# EAGLE design Jig-Lower-Layer (EAGLE 7.7.0)
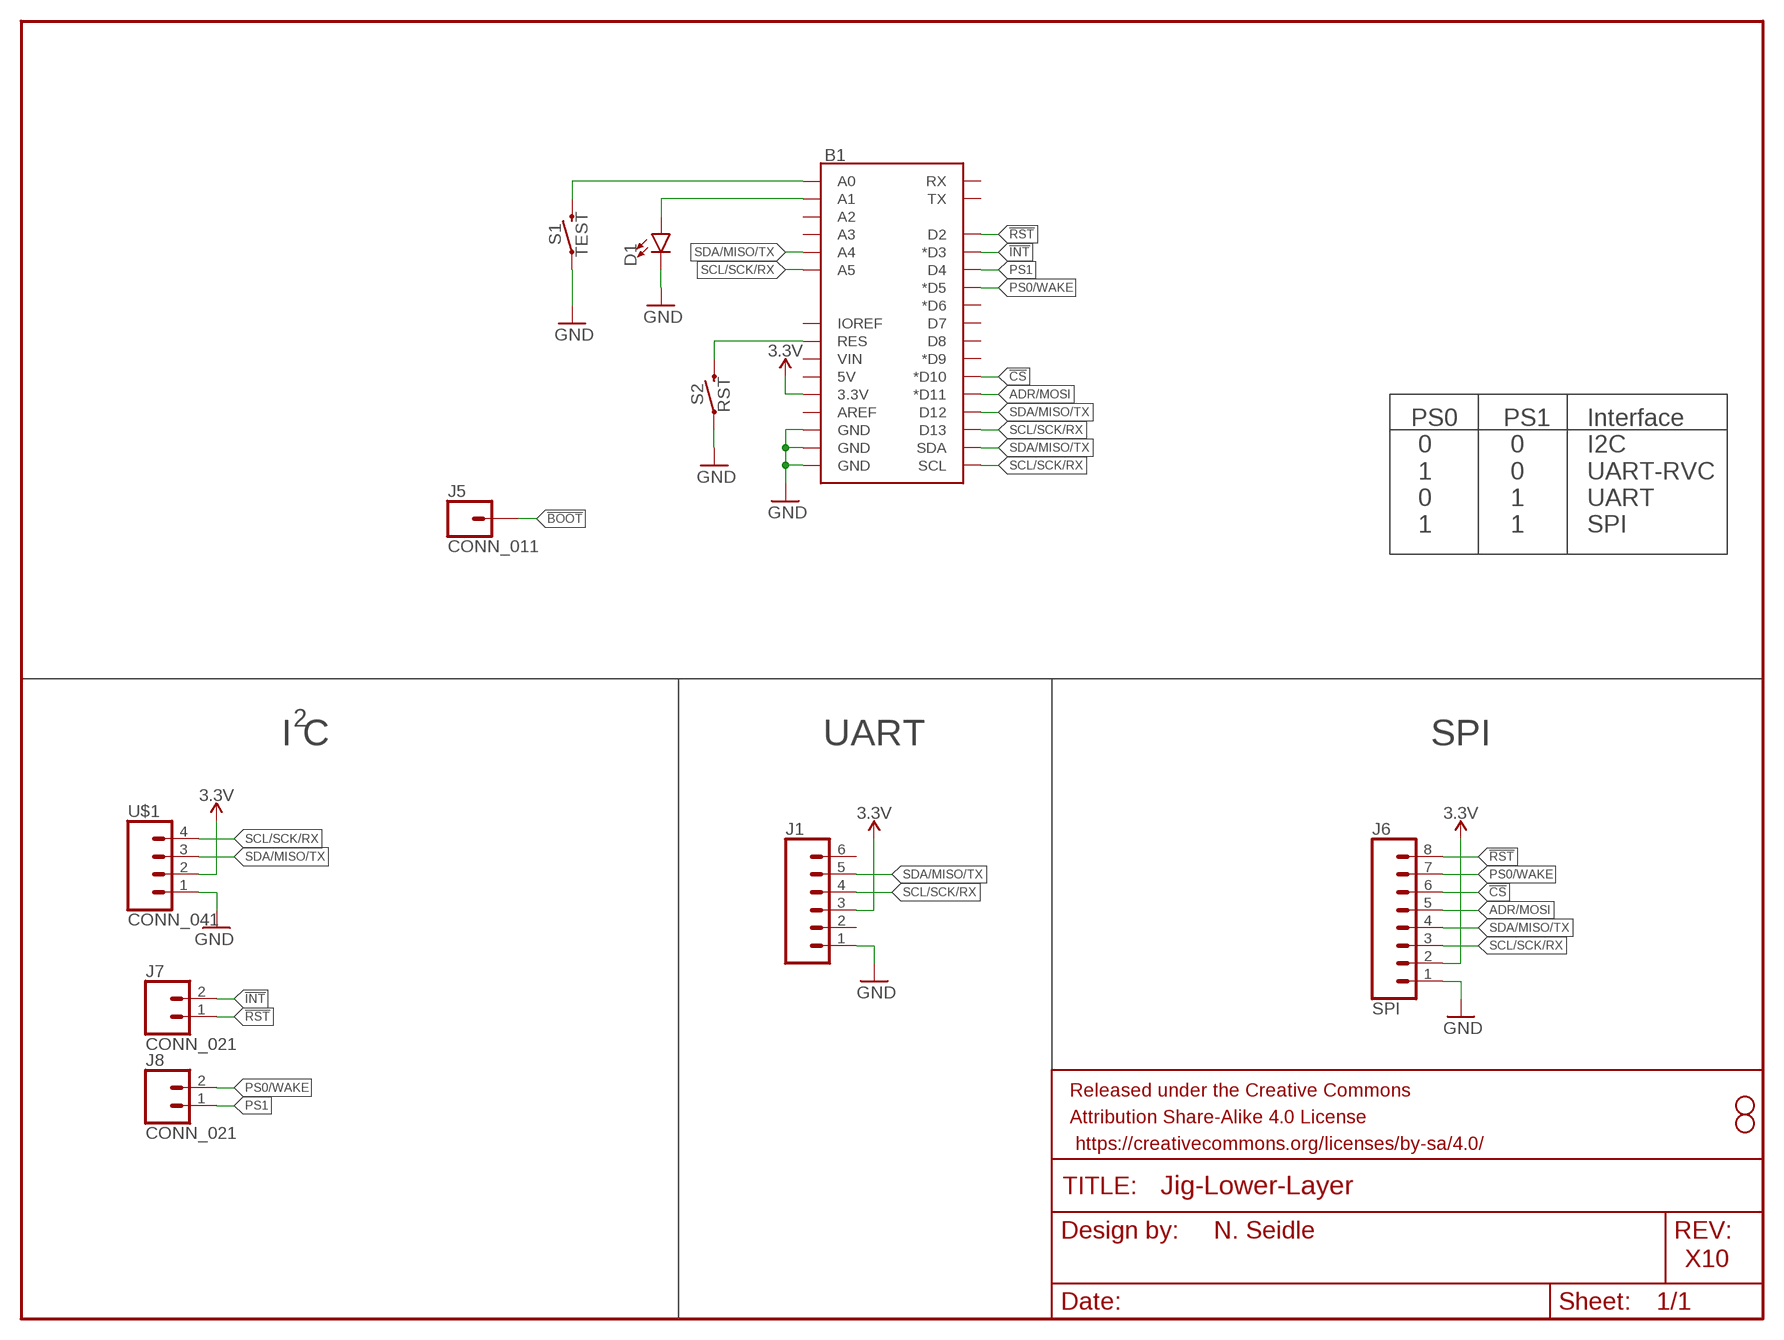
[diagram p0: schematic, sheet 1]

## Parts
B1  ARDUINO_UNO_R3_SHIELDBASIC  [UNO_R3_SHIELD]
D1  LED5MM  [LED_5MM]
FRAME1  FRAME-LETTER  [CREATIVE_COMMONS]
J1  CONN_061  [1X06]
J5  CONN_011  [1X01]
J6  SPI  CONN_081  [1X08]
J7  CONN_021  [1X02]
J8  CONN_021  [1X02]
JP3  STAND-OFF  [STAND-OFF]
JP4  STAND-OFF  [STAND-OFF]
S1  TEST  MOMENTARY-SWITCH-SPST-PTH-12MM  [TACTILE_SWITCH_PTH_12MM]
S2  RST  MOMENTARY-SWITCH-SPST-PTH-12MM  [TACTILE_SWITCH_PTH_12MM]
U$1  CONN_041  [1X04]

## Nets
3.3V: B1.3.3V J1.3 J6.2 U$1.2
!BOOT: J5.1
!CS: B1.D10(*D10) J6.6
!INT: B1.D3(*D3) J7.2
!RST: B1.D2 J6.8 J7.1
ADR/MOSI: B1.D11(*D11) J6.5
GND: B1.GND@0(GND) B1.GND@1(GND) B1.GND@2(GND) D1.K(C) J1.1 J6.1 S1.1 S2.1 U$1.1
N$1: B1.A0 S1.3
N$2: B1.A1 D1.A
N$3: B1.RES S2.3
PS0/WAKE: B1.D5(*D5) J6.7 J8.2
PS1: B1.D4 J8.1
SCL/SCK/RX: B1.A5 B1.D13 B1.SCL J1.4 J6.3 U$1.4
SDA/MISO/TX: B1.A4 B1.D12 B1.SDA J1.5 J6.4 U$1.3
Unconnected: B1.5V B1.A2 B1.A3 B1.AREF B1.D6(*D6) B1.D7 B1.D8 B1.D9(*D9) B1.IOREF B1.RX B1.TX B1.VIN J1.2 J1.6

## Notes on the sheet
- PS0
   0
   1
   0
   1
- PS1
   0
   0
   1
   1
- Interface
  I2C
  UART-RVC
  UART
  SPI
- 2
- I C | UART | SPI
- N. Seidle
- X10

## Library data of the parts
B1 = SparkFun-Boards:ARDUINO_UNO_R3_SHIELD: Arduino R3 Shield Footprint Shield form compatible with the Arduino Uno R3. SparkFun Products: MG2639 Cellular Shield <https://www.sparkfun.com/products/13120> MIDI Shield <https://www.sparkfun.com/products/12898> R3 Stackable Headers Kit <https://www.sparkfun.com/products/11417>
D1 = SparkFun-LED:LED: LED (Generic) Standard schematic elements and footprints for 5mm, 3mm, 1206, and 0603 sized LEDs. Generic LEDs with no color specified.
FRAME1 = SparkFun-Aesthetics:FRAME-LETTER: Schematic Frame - Letter Standard 8.5x11 US Letter frame
J1 = Pogo-Footprints:CONN_06: Multi connection point. Often used as Generic Header-pin footprint for 0.1 inch spaced/style header connections On any of the 0.1 inch spaced packages, you can populate with these: Break Away Headers - Straight <https://www.sparkfun.com/products/116> (PRT-00116) Break Away Male Headers - Right Angle <https://www.sparkfun.com/products/553> (PRT-00553) Female Headers <https://www.sparkfun.com/products/115> (PRT-00115) Break Away Headers - Machine Pin <https://www.sparkfun.com/products/117> (PRT-00117) Break Away Female Headers - Swiss Machine Pin <https://www.sparkfun.com/products/743> (PRT-00743) Arduino Stackable Header - 6 Pin <https://www.sparkfun.com/products/9280> (PRT-09280) For SCREWTERMINALS and SPRING TERMINALS visit here: Screw Terimnals on SparkFun.com <https://www.sparkfun.com/search/results?term=Screw+Terminals> (5mm/3.5mm/2.54mm spacing) This device is also useful as a general connection point to wire up your design to another part of your project. Our various solder wires solder well into these plated through hole pads. Hook-Up Wire - Assortment (Stranded, 22 AWG) <https://www.sparkfun.com/products/11375> (PRT-11375) Hook-Up Wire - Assortment (Solid Core, 22 AWG) <https://www.sparkfun.com/products/11367> (PRT-11367) View the entire wire category on our website here <https://www.sparkfun.com/categories/141>; PROD_ID: CONN-08437
J5 = Pogo-Footprints:CONN_01
J6 = Pogo-Footprints:CONN_08
J7 J8 = Pogo-Footprints:CONN_02
JP3 JP4 = SparkFun:STAND-OFF: Stand Off This is the mechanical footprint for a #4 phillips button head screw. Use the keepout ring to avoid running the screw head into surrounding components. SKU : PRT-00447
S1 S2 = SparkFun-Switches:MOMENTARY-SWITCH-SPST: Momentary Switch (Pushbutton) - SPST Normally-open (NO) SPST momentary switches (buttons, pushbuttons). Variants PTH-12MM - 12mm square, through-hole Momentary Pushbutton Switch - 12mm Square <https://www.sparkfun.com/products/9190> (COM-09190) PTH-6.0MM, PTH-6.0MM-KIT - 6.0mm square, through-hole Mini Pushbutton Switch <https://www.sparkfun.com/products/97> (COM-00097) KIT package intended for soldering kit's - only one side of pads' copper is exposed. PTH-RIGHT-ANGLE-KIT - Right-angle, through-hole Right Angle Tactile Button <https://www.sparkfun.com/products/10791> - Used on SparkFun BigTime Watch Kit <https://www.sparkfun.com/products/11734> SMD-12MM - 12mm square, surface-mount Tactile Button - SMD (12mm) <https://www.sparkfun.com/products/12993> (COM-12993) Used on SparkFun PicoBoard <https://www.sparkfun.com/products/11888> SMD-4.5MM - 4.5mm Square Trackball Switch Used on SparkFun Blackberry Trackballer Breakout <https://www.sparkfun.com/products/13169> SMD-4.6MMX2.8MM - 4.60mm x 2.80mm, surface mount Used on SparkFun SAMD21 Mini Breakout <https://www.sparkfun.com/products/13664> SMD-5.2MM, SMD-5.2-REDUNDANT - 5.2mm square, surface-mount Mini Pushbutton Switch - SMD <https://www.sparkfun.com/products/8720> (COM-08720) Used on Arduino Pro Mini <https://www.sparkfun.com/products/11114> REDUNDANT package connects both switch circuits together SMD-6.0X3.5MM - 6.0 x 3.5mm, surface mount Momentary Reset Switch SMD <https://www.sparkfun.com/products/8229> (COM-08229) SMD-6.2MM-TALL - 6.2mm square, surface mount Tactile Button - SMD (6mm) <https://www.sparkfun.com/products/12992> Used on SparkFun Digital Sandbox <https://www.sparkfun.com/products/12651> SMD-RIGHT-ANGLE - Right-angle, surface mount Used on SparkFun Block for Intel® Edison - Arduino <https://www.sparkfun.com/products/13036>; PROD_ID: SWCH-09185; SF_SKU: COM-09190
U$1 = Pogo-Footprints:CONN_04

## Board
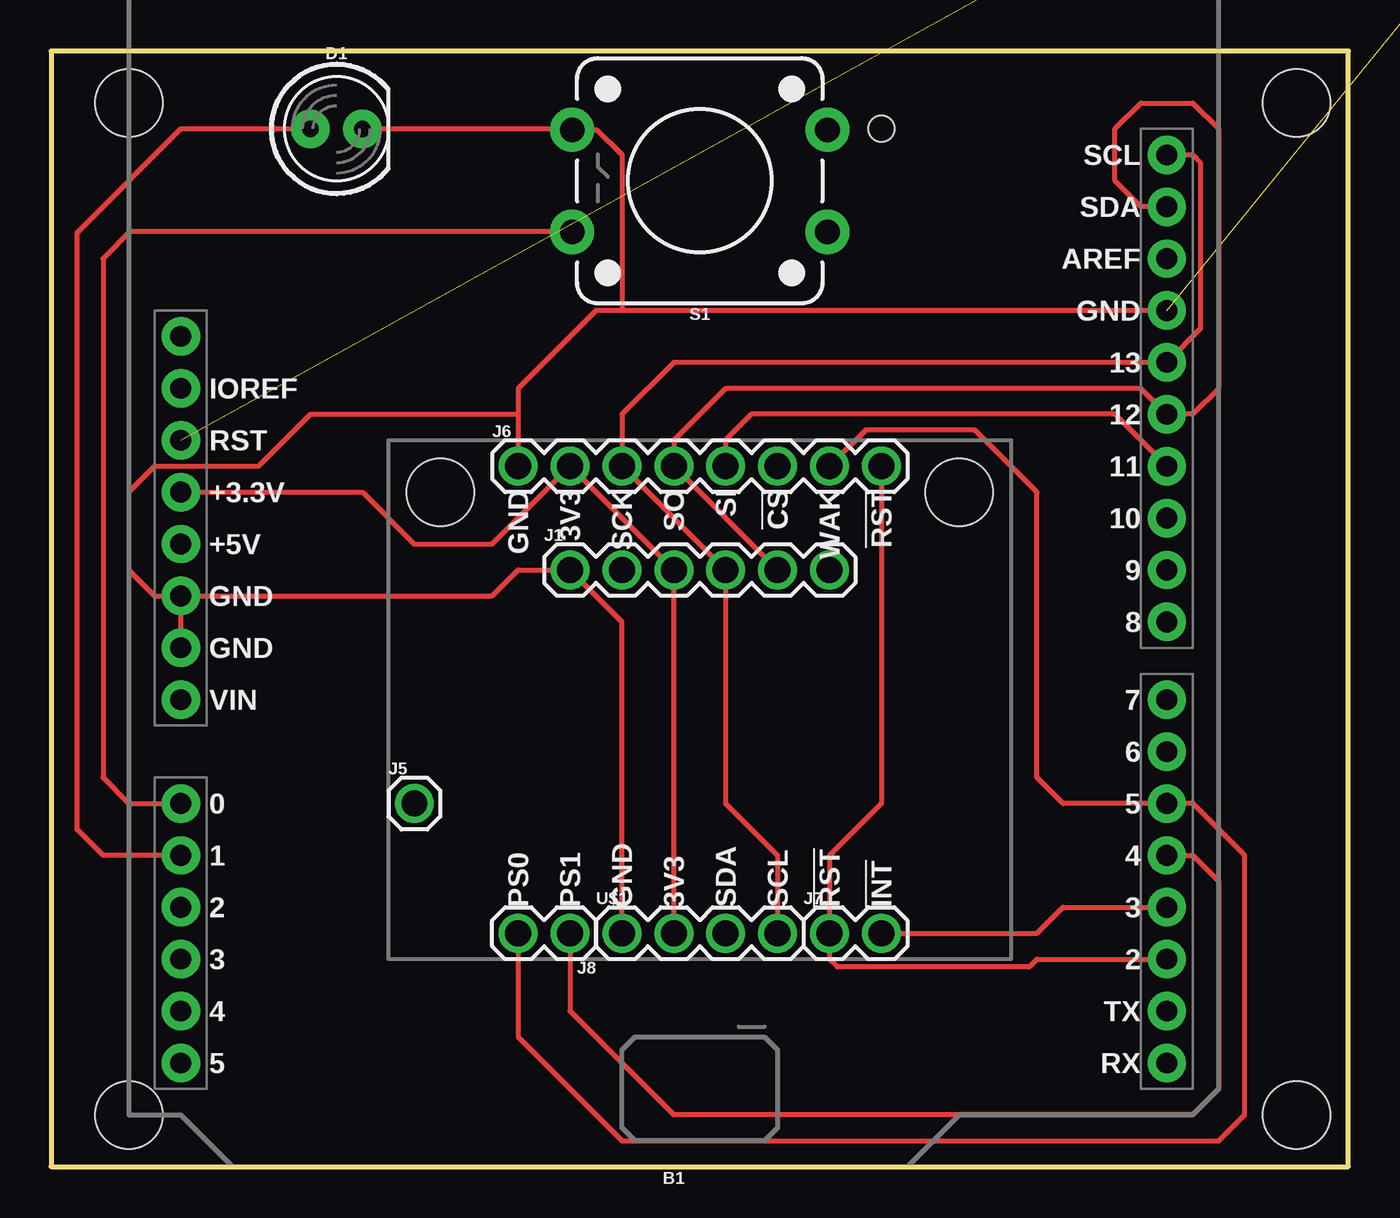
[diagram p1: board, top side]
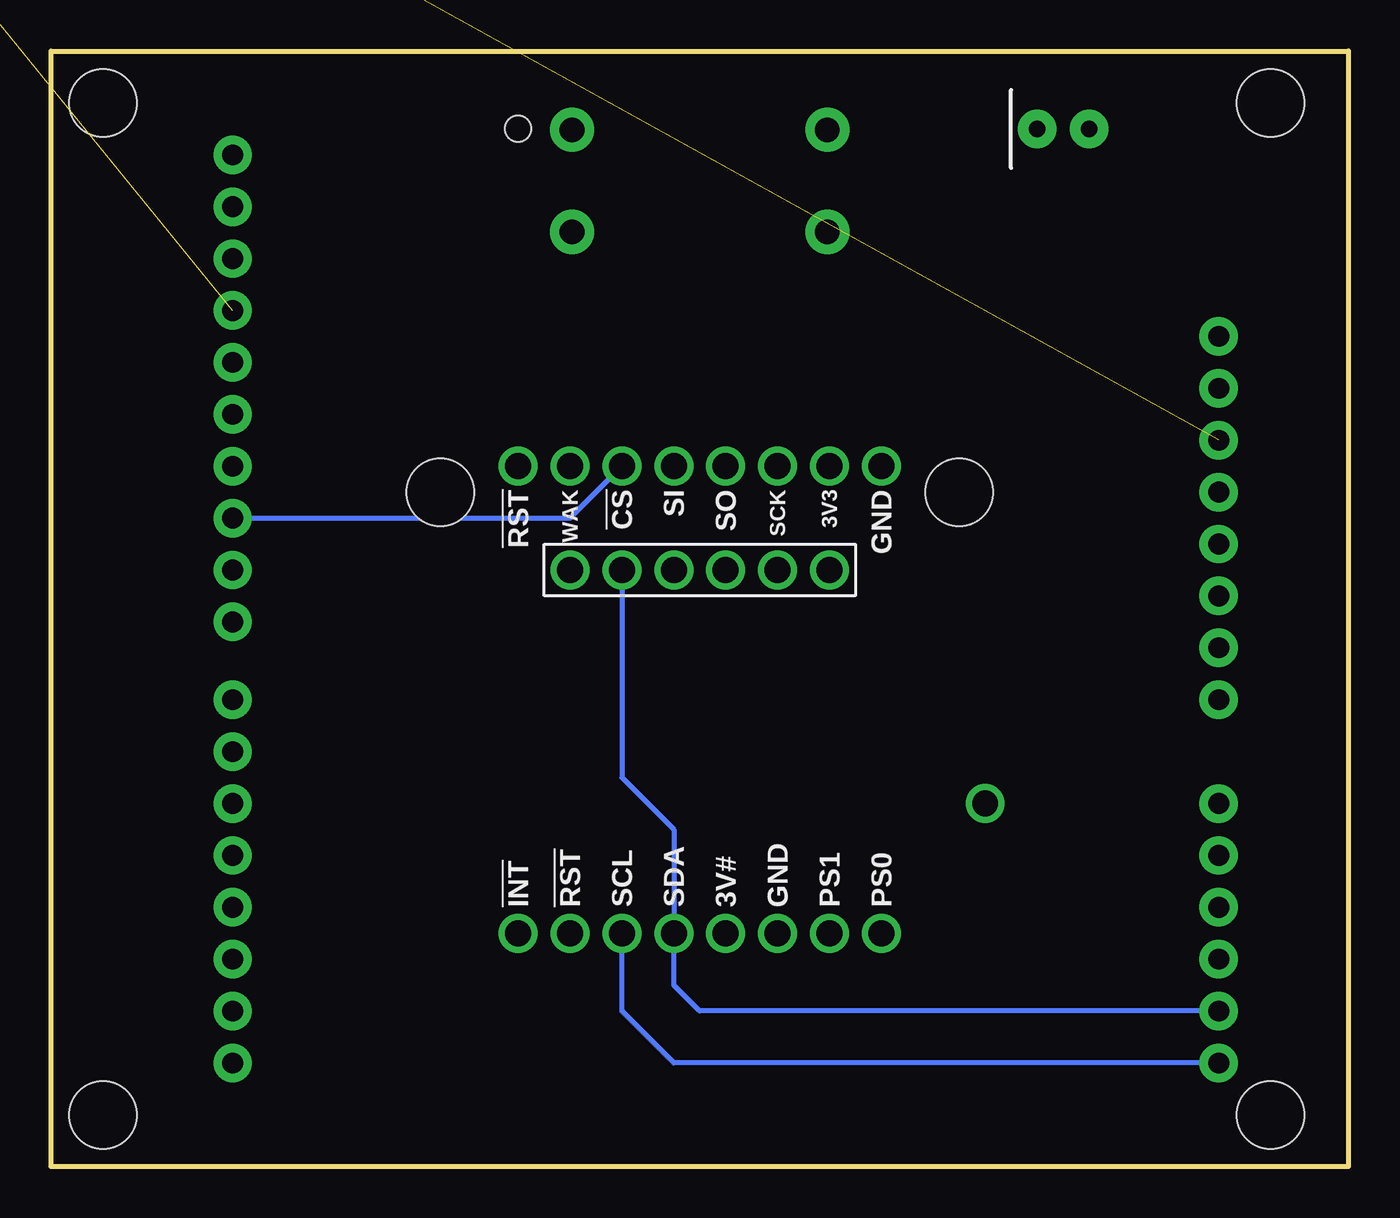
[diagram p2: board, bottom side, seen from below]

Size 63.5 x 54.61 mm. Coordinates in mm from the lower left corner, seen from the top.
Outline: 0,0 63.5,0 63.5,54.61 0,54.61 0,0
Copper layers (1*16): Top 0.035mm / dielectric 1.5mm / Bottom 0.035mm
Design rules "SparkFun-2-layer-PCBWay-LIMIT": minimum track width 6mil, minimum drill 12mil, track to track 6mil, track to pad 6mil, pad to pad 6mil, via to via 6mil, smd to smd 6mil, copper to edge 6mil, drill to drill 6mil, minimum pad ring 7mil, minimum via ring 7mil, stop-mask expansion 4mil, vias tented up to drill 25mil, thermal gap 10mil
Holes 1.27 mm at 40.64,50.8

### Footprints (pad centres in the part's own frame; a part is rotated, then mirrored left to right if it is on the bottom)
UNO_R3_SHIELD = drill 1.016 pad 1.88: 3.3V 24.13,-2.54; 5V 24.13,0; A0 24.13,12.7; A1 24.13,15.24; A2 24.13,17.78; A3 24.13,20.32; A4 24.13,22.86; A5 24.13,25.4; AREF -24.13,-13.97; D2 -24.13,20.32; D3 -24.13,17.78; D4 -24.13,15.24; D5 -24.13,12.7; D6 -24.13,10.16; D7 -24.13,7.62; D8 -24.13,3.81; D9 -24.13,1.27; D10 -24.13,-1.27; D11 -24.13,-3.81; D12 -24.13,-6.35; D13 -24.13,-8.89; GND@0 24.13,2.54; GND@1 24.13,5.08; GND@2 -24.13,-11.43; IOREF 24.13,-7.62; NC 24.13,-10.16; RES 24.13,-5.08; RX -24.13,25.4; SCL -24.13,-19.05; SDA -24.13,-16.51; TX -24.13,22.86; VIN 24.13,7.62
LED_5MM = drill 0.813 pad 1.88: A -1.27,0; K 1.27,0
1X06 = drill 1.27 pad 1.88: 1 0,0; 2 2.54,0; 3 5.08,0; 4 7.62,0; 5 10.16,0; 6 12.7,0
1X01 = drill 1.27 pad 1.88: 1 0,0
1X08 = drill 1.27 pad 1.88: 1 0,0; 2 2.54,0; 3 5.08,0; 4 7.62,0; 5 10.16,0; 6 12.7,0; 7 15.24,0; 8 17.78,0
1X02 = drill 1.27 pad 1.88: 1 0,0; 2 2.54,0
STAND-OFF = hole 3.302: 0,0
TACTILE_SWITCH_PTH_12MM = drill 1.2 pad 2.159: 1 6.25,-2.5; 2 -6.25,-2.5; 3 6.25,2.5; 4 -6.25,2.5
1X04 = drill 1.27 pad 1.88: 1 0,0; 2 2.54,0; 3 5.08,0; 4 7.62,0

### Placement (x,y rotation side)
B1  30.48,30.48 180 top
D1  13.97,50.8 0 top
FRAME1  -19.05,-17.78 0 top  (outside the outline)
J1  25.4,29.21 0 top
J5  17.78,17.78 0 top
J6  22.86,34.29 0 top
J7  38.1,11.43 0 top
J8  25.4,11.43 180 top
JP1  STAND-OFF  [STAND-OFF]  3.81,2.54 0 top
JP2  STAND-OFF  [STAND-OFF]  3.81,52.07 0 top
JP3  19.05,33.02 0 top
JP4  44.45,33.02 0 top
JP5  STAND-OFF  [STAND-OFF]  60.96,52.07 0 top
JP6  STAND-OFF  [STAND-OFF]  60.96,2.54 0 top
S1  31.75,48.26 180 top
S2  71.12,72.39 0 top  (outside the outline)
U$1  27.94,11.43 0 top

### Tracks (layer width: path | path; a pad name or v marks a point on that pad's centre or on a via)
3.3V
  Top 0.254: B1.3.3V 15.24,33.02 17.78,30.48 21.59,30.48 J6.2 J1.3 U$1.2
!CS
  Bottom 0.254: B1.D10 38.1,31.75 J6.6
!INT
  Top 0.254: J7.2 48.26,11.43 49.53,12.7 B1.D3
!RST
  Top 0.254: B1.D2 48.26,10.16 47.88,9.78 38.48,9.78 38.1,10.16 J7.1 38.1,15.24 40.64,17.78 J6.8
ADR/MOSI
  Top 0.254: J6.5 33.02,35.56 34.29,36.83 52.07,36.83 B1.D11
GND  (1 unrouted)
  Top 0.254: B1.GND@2 27.94,41.91 | 27.94,41.91 26.67,41.91 22.86,38.1 22.86,36.83 | 22.86,36.83 J6.1 | B1.GND@0 21.59,27.94 22.86,29.21 J1.1 27.94,26.67 U$1.1 | B1.GND@0 5.08,27.94 3.81,29.21 3.81,33.02 5.08,34.29 10.16,34.29 12.7,36.83 22.86,36.83 | 27.94,41.91 27.94,49.53 26.71,50.76 S1.1 25.46,50.8 D1.K | B1.GND@0 B1.GND@1
N$1
  Top 0.254: S1.3 3.85,45.76 2.54,44.45 2.54,19.05 3.81,17.78 B1.A0
N$2
  Top 0.254: B1.A1 2.54,15.24 1.27,16.51 1.27,45.72 6.35,50.8 D1.A
N$3  (1 unrouted)
PS0/WAKE
  Top 0.254: J6.7 39.88,36.07 45.21,36.07 48.26,33.02 48.26,19.05 49.53,17.78 B1.D5 55.88,17.78 58.42,15.24 58.42,2.54 57.15,1.27 27.94,1.27 22.86,6.35 J8.2
PS1
  Top 0.254: J8.1 25.4,7.62 30.48,2.54 55.88,2.54 57.15,3.81 57.15,13.97 55.88,15.24 B1.D4
SCL/SCK/RX
  Top 0.254: B1.SCL 55.88,49.53 56.26,49.15 56.26,41.02 B1.D13 30.48,39.37 27.94,36.83 J6.3 J1.4 33.02,17.78 35.56,15.24 U$1.4
  Bottom 0.254: B1.A5 33.02,5.08 35.56,7.62 U$1.4
SDA/MISO/TX
  Top 0.254: J1.5 J6.4 30.48,35.56 33.02,38.1 53.34,38.1 B1.D12 55.88,36.83 57.15,38.1 57.15,50.8 55.88,52.07 53.34,52.07 52.07,50.8 52.07,48.26 53.34,46.99 B1.SDA
  Bottom 0.254: B1.A4 31.75,7.62 33.02,8.89 U$1.3 33.02,16.51 35.56,19.05 J1.5

### Text on the board
tPlace: GND | 3V3 | SCK | SO | SI | !CS | WAK | !RST | PS0 | PS1 | GND | 3V3 | SDA | SCL | !RST | !INT
bPlace: GND | 3V3 | SCK | SO | SI | !CS | WAK | !RST | PS0 | PS1 | GND | 3V# | SDA | SCL | !RST | !INT